# Altium schematic sheet ADC.SchDoc: ADC
size A3; Author: M.Beldyga; CompanyName: WUT ISE; DrawnBy: M.Beldyga; Organization: WUT ISE; Address1: PW ISE; Address2: Nowowiejska 15/19 00-665 Warsaw; Address3: micbeldyga@gmail.com; SheetNumber: 4; SheetTotal: 7; ModifiedBy: -; CheckedDate: -; Title2: 2ksps 24b; DivGrp: WUT ISE; Designer: M.Beldyga; ModifiedDate: -; ProjectName: Sensor Box
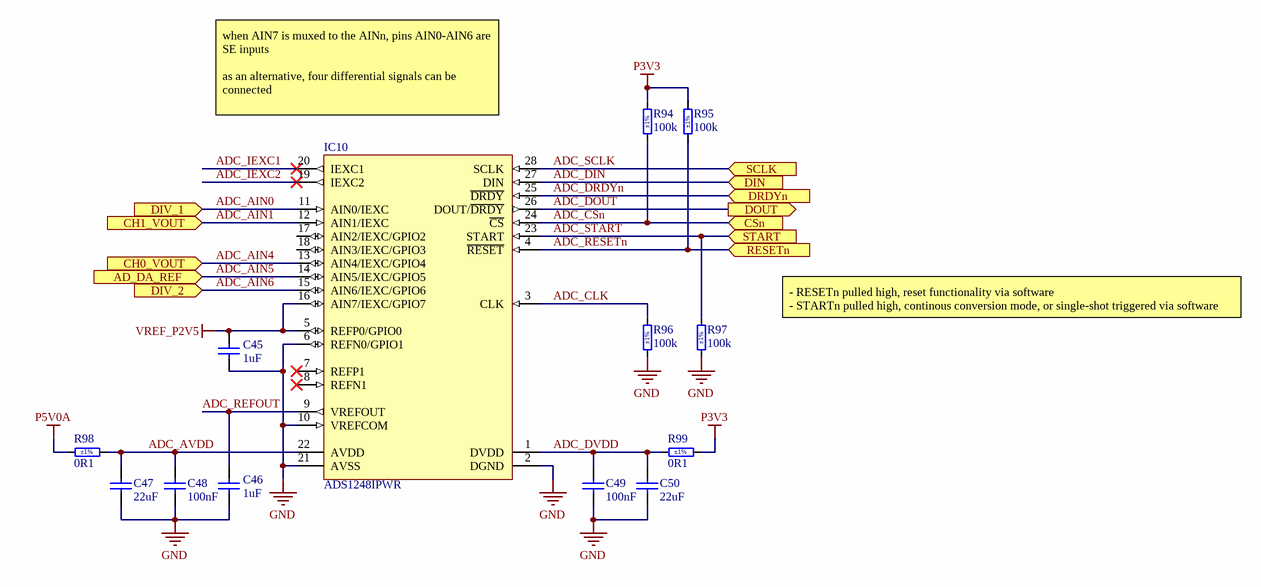
[diagram p0: ADC.SchDoc]

## Parts
C45  1uF  [CAPC1005X55N]
C46  1uF  [CAPC1005X55N]
C47  22uF  [CAPC3216X180N]
C48  100nF  [CAPC1005X55N]
C49  100nF  [CAPC1005X55N]
C50  22uF  [CAPC3216X180N]
IC10  ADS1248IPWR  [SOP65P640X120-28N]
R94  100k  Tolerance: ±1%  [RESC1005X40N]
R95  100k  Tolerance: ±1%  [RESC1005X40N]
R96  100k  Tolerance: ±1%  [RESC1005X40N]
R97  100k  Tolerance: ±1%  [RESC1005X40N]
R98  0R1  Tolerance: ±1%  [RESC1608X55N]
R99  0R1  Tolerance: ±1%  [RESC1608X55N]

## Ports
AD_DA_REF (in), CH0_VOUT (in), CH1_VOUT (in), CSn (in), DIN (in), DIV_1 (in), DIV_2 (in), DOUT (out), DRDYn (in), RESETn (in), SCLK (in), START (in)

## Nets
GND: C45.1 C46.1 C47.1 C48.1 C49.1 C50.1 IC10.2(DGND) IC10.6(REFN0/GPIO1) IC10.10(VREFCOM) IC10.21(AVSS) R96.1 R97.1
P3V3: R94.2 R95.2 R99.1
P5V0A: R98.2
VREF_P2V5: C45.2 IC10.5(REFP0/GPIO0) IC10.16(AIN7/IEXC/GPIO7)
ADC_AIN0: IC10.11(AIN0/IEXC) ; port DIV_1
ADC_AIN1: IC10.12(AIN1/IEXC) ; port CH1_VOUT
ADC_AIN4: IC10.13(AIN4/IEXC/GPIO4) ; port CH0_VOUT
ADC_AIN5: IC10.14(AIN5/IEXC/GPIO5) ; port AD_DA_REF
ADC_AIN6: IC10.15(AIN6/IEXC/GPIO6) ; port DIV_2
ADC_AVDD: C47.2 C48.2 IC10.22(AVDD) R98.1
ADC_CLK: IC10.3(CLK) R96.2
ADC_CSn: IC10.24(~{CS}) R94.1 ; port CSn
ADC_DIN: IC10.27(DIN) ; port DIN
ADC_DOUT: IC10.26(DOUT/~{DRDY}) ; port DOUT
ADC_DRDYn: IC10.25(~{DRDY}) ; port DRDYn
ADC_DVDD: C49.2 C50.2 IC10.1(DVDD) R99.2
ADC_IEXC1: IC10.20(IEXC1)
ADC_IEXC2: IC10.19(IEXC2)
ADC_REFOUT: C46.2 IC10.9(VREFOUT)
ADC_RESETn: IC10.4(~{RESET}) R95.1 ; port RESETn
ADC_SCLK: IC10.28(SCLK) ; port SCLK
ADC_START: IC10.23(START) R97.2 ; port START

Not connected (* = marked no-connect by the designer): IC10 7(REFP1)* 8(REFN1)* 17(AIN2/IEXC/GPIO2) 18(AIN3/IEXC/GPIO3)

## Notes on the sheet
- when AIN7 is muxed to the AINn, pins AIN0-AIN6 are SE inputs
  as an alternative, four differential signals can be connected
- - RESETn pulled high, reset functionality via software
  - STARTn pulled high, continous conversion mode, or single-shot triggered via software
- Project/Equipment
- Document
- Designer
- Drawn by
- Check.by
- Contact
- File
- Last Mod.
- Print Date
- Sheet
- Size
- A3
- of
- Rev

## Library data of the parts
C45 C46 = CC0402_1UF_16V_10%_X5R: Non-polarised capacitor; Part Description: SMD Multilayer Chip Ceramic Capacitor; Manufacturer: GENERIC; Manufacturer1 Part Number: C1005X5R1C105KT; Voltage: 16V; TC: X5R; Tolerance: ±10%; Part Number: CC0402_1UF_16V_10%_X5R; Component Kind: Standard; Component Type: Standard; Pin Count: 2; Value: 1uF; Status: Preferred; Manufacturer Part Number: CC0402_1UF_16V_10%_X5R; Case: 0402; Mounted: Yes; Socket: No; SMD: Yes; Sense: No; Manufacturer1 Example: TDK; Manufacturer1 ComponentHeight: 0.55mm; HelpURL: \\cern.ch\dfs\Applications\Altium\Datasheets\CC0402_X5R_TDK_C.pdf; Author: CERN DEM JLC; CreateDate: 25.10.2012; LatestRevisionDate: 25.10.2012
C47 C50 = CC1206_22UF_25V_20%_X5R: Non-polarised capacitor; Part Description: SMD Multilayer Chip Ceramic Capacitor; Manufacturer: GENERIC; Manufacturer1 Part Number: C3216X5R1E226M160; Voltage: 25V; TC: X5R; Tolerance: ±20%; Part Number: CC1206_22UF_25V_20%_X5R; Component Kind: Standard; Component Type: Standard; Pin Count: 2; Value: 22uF; Status: None; Manufacturer Part Number: CC1206_22UF_25V_20%_X5R; Case: 1206; Mounted: Yes; Socket: No; SMD: Yes; Sense: No; Manufacturer1 Example: TDK; Manufacturer1 ComponentHeight: 1.8mm; HelpURL: \\cern.ch\dfs\Applications\Altium\Datasheets\CC1206_X5R_TDK_C.pdf; Author: CERN DEM WB; CreateDate: 7/25/2018; LatestRevisionDate: 7/25/2018
C48 C49 = CC0402_100NF_50V_10%_X7R: Non-polarised capacitor; Part Description: SMD Multilayer Chip Ceramic Capacitor; Manufacturer: GENERIC; Manufacturer1 Part Number: GRM155R71H104KE14D; Voltage: 50V; TC: X7R; Tolerance: ±10%; Part Number: CC0402_100NF_50V_10%_X7R; Component Kind: Standard; Component Type: Standard; Pin Count: 2; Value: 100nF; Status: None; Manufacturer Part Number: CC0402_100NF_50V_10%_X7R; Case: 0402; Mounted: Yes; Socket: No; SMD: Yes; Sense: No; Manufacturer1 Example: MURATA; Manufacturer1 ComponentHeight: 0.55mm; HelpURL: \\cern.ch\dfs\Applications\Altium\Datasheets\CC0402_MURATA_GRM155R71H104KE14D.pdf; Author: CERN DEM MR; CreateDate: 6/30/2017; LatestRevisionDate: 6/30/2017
IC10 = ADS1248IPWR: 24-Bit Analog-to-Digital Converter for Temperature Sensors; Manufacturer: TEXAS INSTRUMENTS; PressFit: No; Bonding: No; Part Number: ADS1248IPWR; Component Kind: Standard; Component Type: Standard; Device: ADS1248IPWR; PackageDescription: SOP, 0.65mm Pitch; 28 Pin, 4.40mm W X 9.70mm L X 1.20mm H body, IPC Medium Density; Part Description: 24-Bit Analog-to-Digital Converter for Temperature Sensors; Manufacturer Part Number: ADS1248IPWR; Pin Count: 28; Case: TSSOP28; Mounted: Yes; Socket: No; SMD: Yes; Sense: No; ComponentHeight: 1.2mm; Author: CERN DEM JLC; HelpURL: \\cern.ch\dfs\Applications\Altium\Datasheets\ADS1248IPWR.pdf; CreateDate: 3/19/2012; LatestRevisionDate: 3/19/2012
R94-R97 = R0402_100K_1%_0.0625W_100PPM: Resistor - 1%; Part Description: General Purpose Thick Film Chip Resistor; Manufacturer: GENERIC; Manufacturer1 Part Number: 232270671004L; TC: ±100ppm/°C; PressFit: No; Part Number: R0402_100K_1%_0.0625W_100PPM; Component Kind: Standard; Component Type: Standard; Pin Count: 2; Value: 100k; Status: Not Recommended; Power: 0.0625W; Manufacturer Part Number: R0402_100K_1%_0.0625W_100PPM; Case: 0402; Mounted: Yes; Sense: No; Socket: No; SMD: Yes; Manufacturer1 Example: YAGEO PHYCOMP; Manufacturer1 ComponentHeight: 0.4mm; HelpURL: \\cern.ch\dfs\Applications\Altium\Datasheets\R0402_Phycomp_RC0402.pdf; Author: CERN DEM JLC; CreateDate: 12/3/2007; LatestRevisionDate: 10/17/2012
R98 R99 = R0603_0R1_1%_0.1W_200PPM: Resistor - 1%; Part Description: Low Value Chip Resistor; Manufacturer: GENERIC; Manufacturer1 Part Number: CRL0603-FW-R100ELF; Power: 0.1W; TC: ±200ppm/°C; PressFit: No; Part Number: R0603_0R1_1%_0.1W_200PPM; Component Kind: Standard; Component Type: Standard; Pin Count: 2; Value: 0R1; Status: Preferred; Manufacturer Part Number: R0603_0R1_1%_0.1W_200PPM; Case: 0603; Mounted: Yes; Sense: No; Socket: No; SMD: Yes; Manufacturer1 Example: BOURNS; Manufacturer1 ComponentHeight: 0.55mm; HelpURL: \\cern.ch\dfs\Applications\Altium\Datasheets\R0603_BOURNS_CRL.pdf; Author: CERN DEM JMW; CreateDate: 11/26/2019; LatestRevisionDate: 11/26/2019